# EAGLE schematic input_shield (EAGLE 7.7.0)
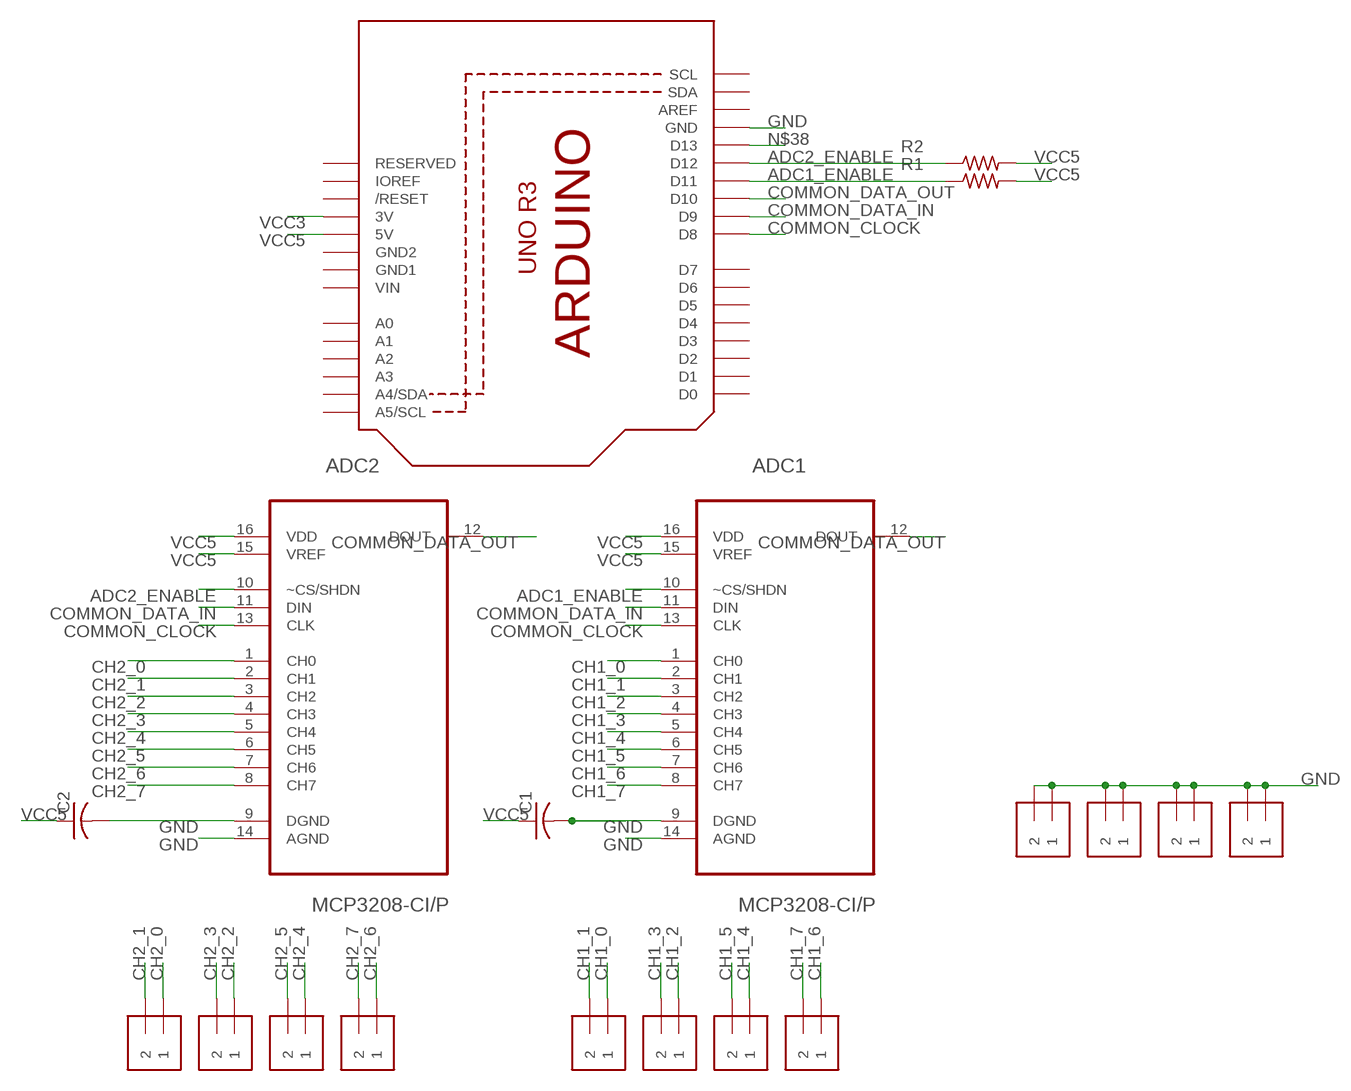
[diagram p0: schematic, sheet 1]

## Parts
ADC1  MCP3208-CI/P  [DIP254P762X432-16]
ADC2  MCP3208-CI/P  [DIP254P762X432-16]
C1  C-US025-025X050  [C025-025X050]
C2  C-US025-025X050  [C025-025X050]
J1  1X2-3.5MM  [1X2-3.5MM]
J2  1X2-3.5MM  [1X2-3.5MM]
J3  1X2-3.5MM  [1X2-3.5MM]
J4  1X2-3.5MM  [1X2-3.5MM]
J5  1X2-3.5MM  [1X2-3.5MM]
J6  1X2-3.5MM  [1X2-3.5MM]
J7  1X2-3.5MM  [1X2-3.5MM]
J8  1X2-3.5MM  [1X2-3.5MM]
J9  1X2-3.5MM  [1X2-3.5MM]
J10  1X2-3.5MM  [1X2-3.5MM]
J11  1X2-3.5MM  [1X2-3.5MM]
J12  1X2-3.5MM  [1X2-3.5MM]
R1  R-US_0204/5  [0204/5]
R2  R-US_0204/5  [0204/5]
U1  ARDUINOR3-DIMENSION  [ARDUINOR3]

## Nets
ADC1_ENABLE: ADC1.10(~CS/SHDN) R1.1 U1.D11
ADC2_ENABLE: ADC2.10(~CS/SHDN) R2.1 U1.D12
CH1_0: ADC1.1(CH0) J5.1
CH1_1: ADC1.2(CH1) J5.2
CH1_2: ADC1.3(CH2) J6.1
CH1_3: ADC1.4(CH3) J6.2
CH1_4: ADC1.5(CH4) J7.1
CH1_5: ADC1.6(CH5) J7.2
CH1_6: ADC1.7(CH6) J8.1
CH1_7: ADC1.8(CH7) J8.2
CH2_0: ADC2.1(CH0) J1.1
CH2_1: ADC2.2(CH1) J1.2
CH2_2: ADC2.3(CH2) J2.1
CH2_3: ADC2.4(CH3) J2.2
CH2_4: ADC2.5(CH4) J3.1
CH2_5: ADC2.6(CH5) J3.2
CH2_6: ADC2.7(CH6) J4.1
CH2_7: ADC2.8(CH7) J4.2
COMMON_CLOCK: ADC1.13(CLK) ADC2.13(CLK) U1.D8
COMMON_DATA_IN: ADC1.11(DIN) ADC2.11(DIN) U1.D9
COMMON_DATA_OUT: ADC1.12(DOUT) ADC2.12(DOUT) U1.D10
GND: ADC1.9(DGND) ADC1.14(AGND) ADC2.9(DGND) ADC2.14(AGND) C1.2 C2.2 J9.1 J9.2 J10.1 J10.2 J11.1 J11.2 J12.1 J12.2 U1.GND
N$38: U1.D13
VCC3: U1.3V
VCC5: ADC1.15(VREF) ADC1.16(VDD) ADC2.15(VREF) ADC2.16(VDD) C1.1 C2.1 R1.2 R2.2 U1.5V
Unconnected: U1.A0 U1.A1 U1.A2 U1.A3 U1.A4(A4/SDA) U1.A5(A5/SCL) U1.AREF U1.D0 U1.D1 U1.D2 U1.D3 U1.D4 U1.D5 U1.D6 U1.D7 U1.IOREF U1.RESERVED U1.RESET(/RESET) U1.SCL U1.SDA

## Power pins joined to a net without a drawn wire
GND1: U1.GND1
GND2: U1.GND2
VIN: U1.VIN

## Library data of the parts
ADC1 ADC2 = Microchip_By_element14_Batch_1:MCP3208-CI/P: A/D Converters; MPN: MCP3208-CI/P; OC_FARNELL: 1084269; OC_NEWARK: 58K1815; PACKAGE: DIP-16; SUPPLIER: Microchip
C1 C2 = resistor:C-US: CAPACITOR, American symbol
J1-J12 = adafruit:1X2: 3.5mm Terminal block http://www.ladyada.net/library/pcb/eaglelibrary.html
R1 R2 = resistor:R-US_: RESISTOR, American symbol
U1 = adafruit:ARDUINOR3: This is a new object for the new Arduino R3 - with extra pins that you may want to use (such as IOref, and duplicated A4/A5